# Altium schematic sheet Sheet1.SchDoc
size A4; SheetNumber: 1; SheetTotal: 1
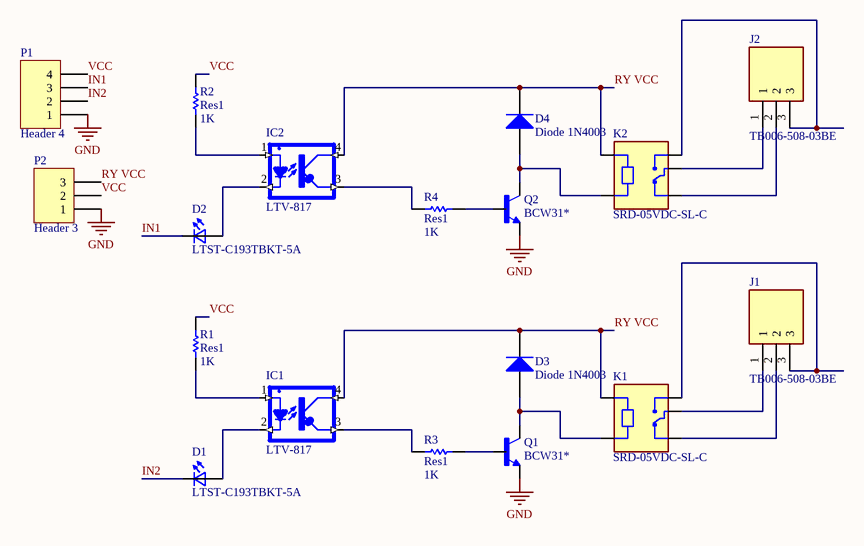
[diagram p0: Sheet1.SchDoc]

## Parts
D1  LTST-C193TBKT-5A  [0603]
D2  LTST-C193TBKT-5A  [0603]
D3  Diode 1N4003  [DO-41]
D4  Diode 1N4003  [DO-41]
IC1  LTV-817  [DIP-4]
IC2  LTV-817  [DIP-4]
J1  TB006-508-03BE  [CUI_TB006-508-03BE]
J2  TB006-508-03BE  [CUI_TB006-508-03BE]
K1  SRD-05VDC-SL-C  [RELAY_SRD-05VDC-SL-C]
K2  SRD-05VDC-SL-C  [RELAY_SRD-05VDC-SL-C]
P1  Header 4  [HDR1X4]
P2  Header 3  [HDR1X3]
Q1  BCW31*  [SOT23-BEC]
Q2  BCW31*  [SOT23-BEC]
R1  Res1  value 1K  [AXIAL-0.3]
R2  Res1  value 1K  [AXIAL-0.3]
R3  Res1  value 1K  [AXIAL-0.3]
R4  Res1  value 1K  [AXIAL-0.3]

## Nets
GND: P1.1 P2.1 Q1.E Q2.E
IN1: D2.1(K2) P1.3
IN2: D1.1(K2) P1.2
RY VCC: D3.2(K) D4.2(K) IC1.4 IC2.4 K1.A1 K2.A1 P2.3
VCC: P1.4 P2.2 R1.2 R2.2
NetD1_2: D1.2(A2) IC1.2
NetD2_2: D2.2(A2) IC2.2
NetD3_1: D3.1(A) K1.A2 Q1.C
NetD4_1: D4.1(A) K2.A2 Q2.C
NetIC1_1: IC1.1 R1.1
NetIC1_3: IC1.3 R3.1
NetIC2_1: IC2.1 R2.1
NetIC2_3: IC2.3 R4.1
NetJ1_1: J1.1 K1.COM
NetJ1_2: J1.2 K1.NC
NetJ1_3: J1.3 K1.NO
NetJ2_1: J2.1 K2.COM
NetJ2_2: J2.2 K2.NC
NetJ2_3: J2.3 K2.NO
NetQ1_B: Q1.B R3.2
NetQ2_B: Q2.B R4.2

## Library data of the parts
D1 D2 = LTST-C193TBKT-5A: Blue 470nm LED Indication - Discrete 2.8V 0603 _1608 Metric_; MF: Lite-On Inc.; MP: LTST-C193TBKT-5A; Value: *; Digi-Key_Purchase_URL: https://www.digikey.com/product-detail/en/lite-on-inc/LTST-C193TBKT-5A/160-1827-1-ND/2355044?utm_source=snapeda&utm_medium=aggregator&utm_campaign=symbol; SnapEDA_Link: https://www.snapeda.com/parts/LTST-C193TBKT-5A/Lite-On%20Inc./view-part/350303/?ref=snap; Digi-Key_Part_Number: 160-1827-1-ND; Package: 0603 Lite-On
D3 D4 = Diode 1N4003: 1 Amp General Purpose Rectifier; Published: 8-Jun-2000; LatestRevisionDate: 17-Jul-2002; LatestRevisionNote: Re-released for DXP Platform.; DatasheetVersion: 1998; PackageVersion: Aug-1999; PackageReference: DO-41; Publisher: Altium Limited; PackageDescription: Diode, Axial; Body 5.2 x 2.7 mm (LxDia. max), Lead Dia. 0.86 mm (max); Code_JEDEC: DO-204-AL; ComponentLink1Description: Manufacturer Link; ComponentLink1URL: http://www.fairchildsemi.com/; ComponentLink2Description: Datasheet; ComponentLink2URL: http://www.fairchildsemi.com/ds/1N%2F1N4001.pdf
IC1 IC2 = LTV-817: Optoisolator Transistor Output 5000Vrms 1 Channel 4-SMD; MF: Lite-On Electronics; SnapEDA_Link: https://www.snapeda.com/parts/LTV-817/ICS/view-part/4478599/?ref=snap; Price: None; MP: LTV-817; Value: *; Availability: Unavailable; Package: DIP-4 Lite-On Electronics
J1 J2 = TB006-508-03BE: 2~24 Poles, Screw Type, Horizontal, 5.08 Pitch, 26~14 (AWG), Terminal Block Connector; MF: CUI Devices; Price: None; CUI_purchase_URL: https://www.cuidevices.com/product/interconnect/connectors/terminal-blocks/tb006-508-series?utm_source=snapeda.com&utm_medium=referral&utm_campaign=snapedaBOM; Purchase-URL: https://pricing.snapeda.com/search/part/TB006-508-03BE/?ref=eda; MP: TB006-508-03BE; Value: *; Package: None; SnapEDA_Link: https://www.snapeda.com/parts/TB006-508-03BE/CUI+Devices/view-part/?ref=snap; Availability: In Stock; Check_prices: https://www.snapeda.com/parts/TB006-508-03BE/CUI+Devices/view-part/?ref=eda
K1 K2 = SRD-05VDC-SL-C: 5V Trigger Relay Module For Arduino And Raspberry Pi 5V Trigger Relay Module For Arduino And Raspberry Pi; MF: Songle Relay; Price: None; Availability: Not in stock; MP: SRD-05VDC-SL-C; Package: NON STANDARD-5 Songle Relay; SnapEDA_Link: https://www.snapeda.com/parts/SRD-05VDC-SL-C/Songle+Relay/view-part/?ref=snap; Check_prices: https://www.snapeda.com/parts/SRD-05VDC-SL-C/Songle+Relay/view-part/?ref=eda; Value: *
P1 = Header 4: Header, 4-Pin; LatestRevisionDate: 17-Jul-2002; LatestRevisionNote: Re-released for DXP Platform.; Publisher: Altium Limited
P2 = Header 3: Header, 3-Pin; LatestRevisionDate: 17-Jul-2002; LatestRevisionNote: Re-released for DXP Platform.; Publisher: Altium Limited
Q1 Q2 = BCW31*: Bipolar _BJT_ Transistor NPN General Purpose Amplifier Surface Mount; MF: ON Semiconductor; MP: BCW31; Package: SOT-23 ON Semiconductor; Value: *; Availability: Unavailable; SnapEDA_Link: https://www.snapeda.com/parts/BCW31/ON%20Semiconductor/view-part/573820/?ref=snap; Price: None
R1-R4 = Res1: Resistor; Published: 8-Jun-2000; LatestRevisionDate: 17-Jul-2002; LatestRevisionNote: Re-released for DXP Platform.; PackageReference: AXIAL-0.3; Publisher: Altium Limited; PackageDescription: Axial Device, Thru-Hole; 2 Leads; 0.3 in Pin Spacing